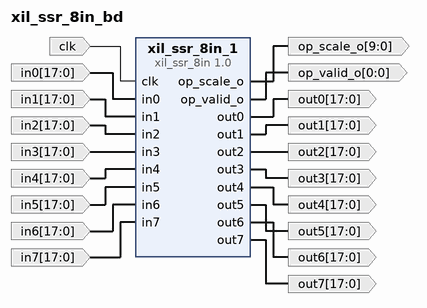
[diagram p0: block diagram of the top level]
# Vivado block design xil_ssr_8in_bd, xcvu37p-fsvh2892-2L-e, Vivado 2021.1
create_bd_design xil_ssr_8in_bd

create_bd_port -dir I -type clk clk
create_bd_port -dir I -from 17 -to 0 -type data in0
create_bd_port -dir I -from 17 -to 0 -type data in1
create_bd_port -dir I -from 17 -to 0 -type data in2
create_bd_port -dir I -from 17 -to 0 -type data in3
create_bd_port -dir I -from 17 -to 0 -type data in4
create_bd_port -dir I -from 17 -to 0 -type data in5
create_bd_port -dir I -from 17 -to 0 -type data in6
create_bd_port -dir I -from 17 -to 0 -type data in7
create_bd_port -dir O -from 9 -to 0 -type data op_scale_o
create_bd_port -dir O -from 0 -to 0 -type data op_valid_o
create_bd_port -dir O -from 17 -to 0 -type data out0
create_bd_port -dir O -from 17 -to 0 -type data out1
create_bd_port -dir O -from 17 -to 0 -type data out2
create_bd_port -dir O -from 17 -to 0 -type data out3
create_bd_port -dir O -from 17 -to 0 -type data out4
create_bd_port -dir O -from 17 -to 0 -type data out5
create_bd_port -dir O -from 17 -to 0 -type data out6
create_bd_port -dir O -from 17 -to 0 -type data out7

create_bd_cell -type ip -vlnv User_Company:SysGen:xil_ssr_8in:1.0 xil_ssr_8in_1

# ---- connections ----

connect_bd_net [get_bd_ports clk] [get_bd_pins xil_ssr_8in_1/clk]
connect_bd_net -net in0_1 [get_bd_ports in0] [get_bd_pins xil_ssr_8in_1/in0]
connect_bd_net -net in1_1 [get_bd_ports in1] [get_bd_pins xil_ssr_8in_1/in1]
connect_bd_net -net in2_1 [get_bd_ports in2] [get_bd_pins xil_ssr_8in_1/in2]
connect_bd_net -net in3_1 [get_bd_ports in3] [get_bd_pins xil_ssr_8in_1/in3]
connect_bd_net -net in4_1 [get_bd_ports in4] [get_bd_pins xil_ssr_8in_1/in4]
connect_bd_net -net in5_1 [get_bd_ports in5] [get_bd_pins xil_ssr_8in_1/in5]
connect_bd_net -net in6_1 [get_bd_ports in6] [get_bd_pins xil_ssr_8in_1/in6]
connect_bd_net -net in7_1 [get_bd_ports in7] [get_bd_pins xil_ssr_8in_1/in7]
connect_bd_net [get_bd_pins xil_ssr_8in_1/op_scale_o] [get_bd_ports op_scale_o]
connect_bd_net [get_bd_pins xil_ssr_8in_1/op_valid_o] [get_bd_ports op_valid_o]
connect_bd_net [get_bd_pins xil_ssr_8in_1/out0] [get_bd_ports out0]
connect_bd_net [get_bd_pins xil_ssr_8in_1/out1] [get_bd_ports out1]
connect_bd_net [get_bd_pins xil_ssr_8in_1/out2] [get_bd_ports out2]
connect_bd_net [get_bd_pins xil_ssr_8in_1/out3] [get_bd_ports out3]
connect_bd_net [get_bd_pins xil_ssr_8in_1/out4] [get_bd_ports out4]
connect_bd_net [get_bd_pins xil_ssr_8in_1/out5] [get_bd_ports out5]
connect_bd_net [get_bd_pins xil_ssr_8in_1/out6] [get_bd_ports out6]
connect_bd_net [get_bd_pins xil_ssr_8in_1/out7] [get_bd_ports out7]

validate_bd_design
save_bd_design
